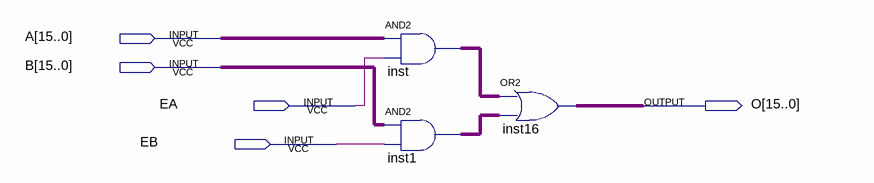
[diagram p0: schematic sheet]
// Quartus schematic SELECT2-16-B.bdf as structural Verilog: 3 symbols, 5 pins
module \SELECT2-16-B  (
  input  [15:0] A,
  input  [15:0] B,
  input  EA,
  input  EB,
  output [15:0] O
);

  wire [15:0] inst1_out, inst_out;

  assign inst_out = A & {16{EA}};  // AND2 inst, 16 bits wide
  assign inst1_out = B & {16{EB}};  // AND2 inst1, 16 bits wide
  assign O = inst_out | inst1_out;  // OR2 inst16, 16 bits wide
endmodule
